# EAGLE design combined (EAGLE 6.6.0)
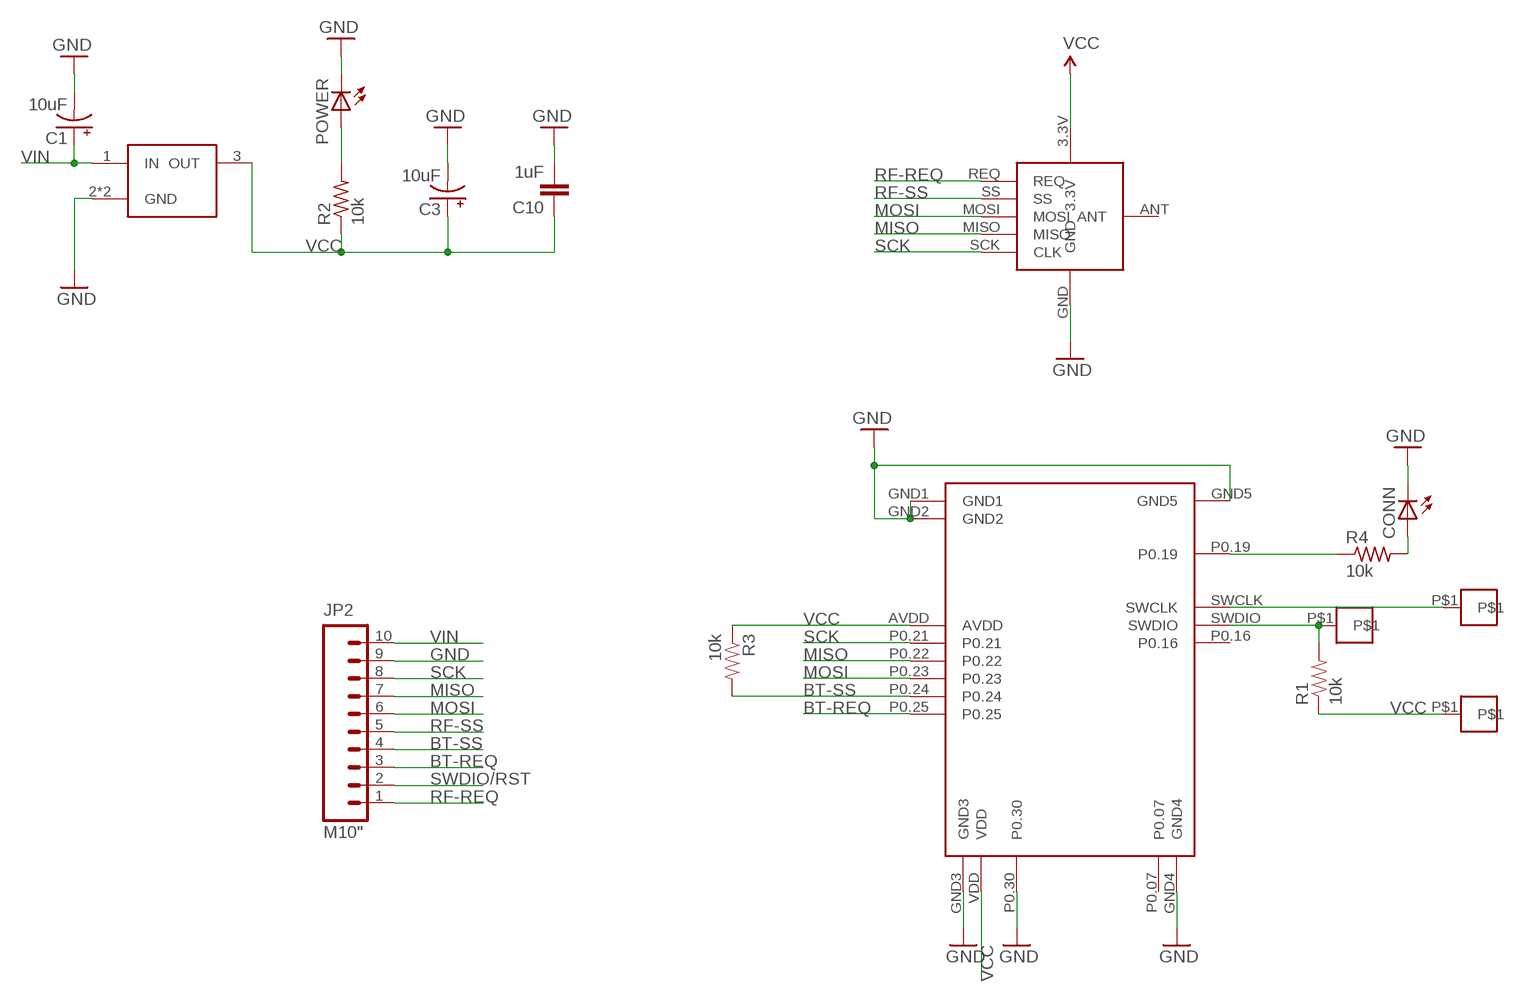
[diagram p0: schematic, sheet 1]

## Parts
C1  10uF  CAP_POL1206  [EIA3216]
C3  10uF  CAP_POL1206  [EIA3216]
C10  1uF  CAP0603-CAP  [0603-CAP]
CLOCK  PAD  [SMD-ROUND]
CLOCK1  PAD  [SMD-ROUND]
CONN  LEDCHIP-LED0603  [CHIP-LED0603]
JP2  M10"  [1X10]
POWER  LEDCHIP-LED0603  [CHIP-LED0603]
R1  10k  RESISTOR0603  [0603-RES]
R2  10k  R-US_R0603  [R0603]
R3  10k  RESISTOR0603  [0603-RES]
R4  10k  R-US_R0603  [R0603]
U$1  RFM69  [S0C-RFM69]
U$3  REGULATOR3.3V-UA78M33CDCYR  [SOT223]
U$5  NRF51-MDBT40-SPI  [SOC-NRF51-MDBT40-SPI]
VCC  PAD  [SMD-ROUND]

## Nets
BT-REQ: JP2.3 U$5.P0.25
BT-SS: JP2.4 R3.2 U$5.P0.24
GND [vcc]: C1.C(-) C3.C(-) C10.2 CONN.C JP2.9 POWER.C U$1.GND U$3.2(GND) U$3.4(GND) U$5.GND1 U$5.GND2 U$5.GND3 U$5.GND4 U$5.GND5 U$5.P0.30
MISO: JP2.7 U$1.MISO U$5.P0.22
MOSI: JP2.6 U$1.MOSI U$5.P0.23
N$1: POWER.A R2.2
N$2: R4.1 U$5.P0.19
N$4: CONN.A R4.2
N$11: CLOCK.P$1 U$5.SWCLK
RF-REQ: JP2.1 U$1.REQ
RF-SS: JP2.5 U$1.SS
SCK: JP2.8 U$1.SCK(CLK) U$5.P0.21
SWDIO/RST: CLOCK1.P$1 JP2.2 R1.2 U$5.SWDIO
VCC: C3.A(+) C10.1 R1.1 R2.1 R3.1 U$1.3.3V U$3.3(OUT) U$5.AVDD U$5.VDD VCC.P$1
VIN: C1.A(+) JP2.10 U$3.1(IN)
Unconnected: U$1.ANT U$5.P0.07 U$5.P0.16

## Library data of the parts
C1 C3 = SparkFun-Capacitors:CAP_POL: Capacitor Polarized These are standard SMD and PTH capacitors. Normally 10uF, 47uF, and 100uF in electrolytic and tantalum varieties. Always verify the external diameter of the through hole cap, it varies with capacity, voltage, and manufacturer. The EIA devices should be standard.
C10 = SparkFun:CAP: Capacitor Standard 0603 ceramic capacitor, and 0.1" leaded capacitor.
CLOCK CLOCK1 VCC = ITP_Lab:PAD
CONN POWER = adafruit:LED: LED OSRAM: - CHIPLED LG R971, LG N971, LY N971, LG Q971, LY Q971, LO R971, LY R971 LH N974, LH R974 LS Q976, LO Q976, LY Q976 LO Q996 - Hyper CHIPLED LW Q18S LB Q993, LB Q99A, LB R99A - SideLED LS A670, LO A670, LY A670, LG A670, LP A670 LB A673, LV A673, LT A673, LW A673 LH A674 LY A675 LS A676, LA A676, LO A676, LY A676, LW A676 LS A679, LY A679, LG A679 - Hyper Micro SIDELED® LS Y876, LA Y876, LO Y876, LY Y876 LT Y87S - SmartLED LW L88C, LW L88S LB L89C, LB L89S, LG L890 LS L89K, LO L89K, LY L89K LS L896, LA L896, LO L896, LY L896 - TOPLED LS T670, LO T670, LY T670, LG T670, LP T670 LSG T670, LSP T670, LSY T670, LOP T670, LYG T670 LG T671, LOG T671, LSG T671 LB T673, LV T673, LT T673, LW T673 LH T674 LS T676, LA T676, LO T676, LY T676, LB T676, LH T676, LSB T676, LW T676 LB T67C, LV T67C, LT T67C, LS T67K, LO T67K, LY T67K, LW E67C LS E67B, LA E67B, LO E67B, LY E67B, LB E67C, LV E67C, LT E67C LW T67C LS T679, LY T679, LG T679 LS T770, LO T770, LY T770, LG T770, LP T770 LB T773, LV T773, LT T773, LW T773 LH T774 LS E675, LA E675, LY E675, LS T675 LS T776, LA T776, LO T776, LY T776, LB T776 LHGB T686 LT T68C, LB T68C - Hyper Mini TOPLED® LB M676 - Mini TOPLED Santana® LG M470 LS M47K, LO M47K, LY M47K Source: http://www.osram.convergy.de/
JP2 = SparkFun-Connectors:M10: Header 10 Standard 10-pin 0.1" header. Use with straight break away headers (SKU : PRT-00116), right angle break away headers (PRT-00553), swiss pins (PRT-00743), machine pins (PRT-00117), and female headers (PRT-00115).
R1 R3 = SparkFun-Resistors:RESISTOR: Resistor Basic schematic elements and footprints for 0603, 1206, and PTH resistors.
R2 R4 = adafruit:R-US_: RESISTOR, American symbol
U$1 = ITP_Lab:RFM69
U$3 = ITP_Lab:REGULATOR
U$5 = ITP_Lab:NRF51-MDBT40-SPI

## Net classes
0 default: width 0.203 mm
1 vcc: width 0.254 mm

## Board
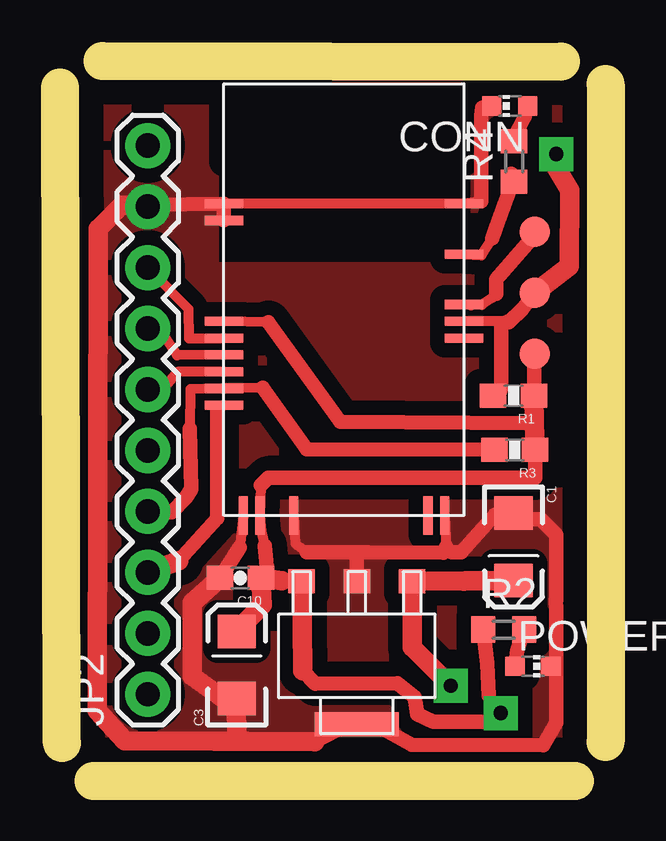
[diagram p1: board, top side]
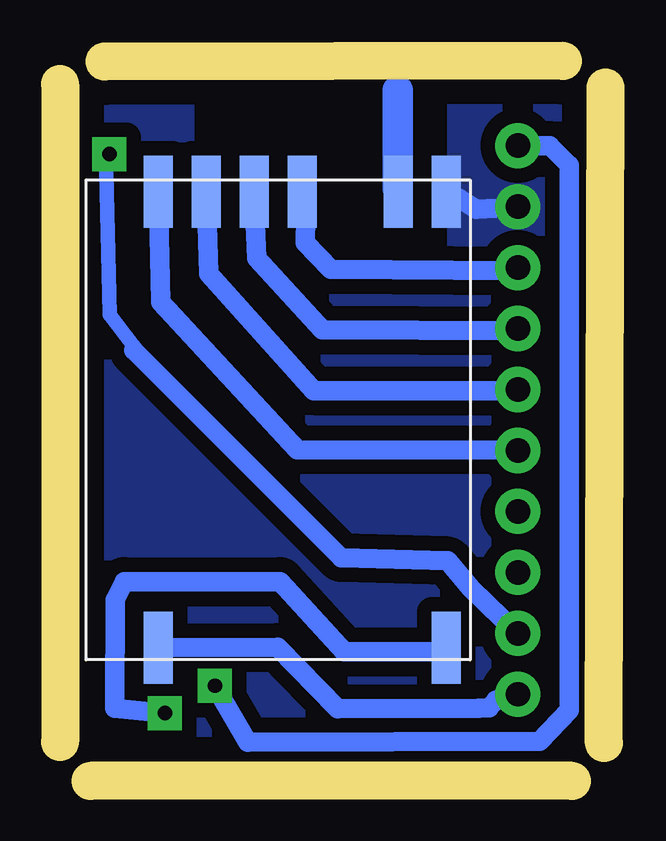
[diagram p2: board, bottom side, seen from below]

Size 22.73 x 30 mm. Coordinates in mm from the lower left corner, seen from the top.
Outline: 1.78,30 20.88,29.97
Outline: 22.73,29.03 22.73,1.63
Outline: 1.4,0 21.46,0
Outline: 0.08,1.58 0,28.88
Copper layers (1*16): Top 0.035mm / dielectric 1.5mm / Bottom 0.035mm
Design rules "default": minimum track width 10mil, minimum drill 24mil, track to track 8mil, track to pad 8mil, pad to pad 8mil, via to via 8mil, smd to smd 8mil, copper to edge 40mil, drill to drill 8mil, minimum pad ring 10mil, minimum via ring 8mil, stop-mask expansion 4mil, vias tented up to drill 0mil, thermal gap 10mil

### Footprints (pad centres in the part's own frame; a part is rotated, then mirrored left to right if it is on the bottom)
EIA3216 = smd 1.4 x 1.6: A 1.4,0; C -1.4,0
0603-CAP = smd 1.1 x 1: 1 -0.85,0; 2 0.85,0
SMD-ROUND = smd 1.27 x 1.27: P$1 0,0
CHIP-LED0603 = smd 0.8 x 0.8: A 0,-0.75; C 0,0.75
1X10 = drill 1.016 pad 1.88: 1 0,0; 2 2.54,0; 3 5.08,0; 4 7.62,0; 5 10.16,0; 6 12.7,0; 7 15.24,0; 8 17.78,0; 9 20.32,0; 10 22.86,0
0603-RES = smd 1.1 x 1: 1 -0.85,0; 2 0.85,0
R0603 = smd 1 x 1.1: 1 -0.85,0; 2 0.85,0
S0C-RFM69 = smd 3 x 1.2: 3.3V -9.5,-7; ANT 9.5,-5; GND 9.5,-7; MISO 9.5,1; MOSI 9.5,3; REQ -9.5,5; SCK 9.5,-1; SS 9.5,5
SOT223 = smd 1.1 x 1: 1 -2.3,-3.1; 2 0,-3.1; 3 2.3,-3.1 | smd 3.5 x 1: 4 0,2.85
SOC-NRF51-MDBT40-SPI = smd 1.6 x 0.381: AVDD -5.08,0.48; GND1 -5.08,5.38; GND2 -5.08,4.68; GND5 4.92,5.38; P0.16 4.92,-0.22; P0.19 4.92,3.28; P0.21 -5.08,-0.22; P0.22 -5.08,-0.92; P0.23 -5.08,-1.62; P0.24 -5.08,-2.32; P0.25 -5.08,-3.02; SWCLK 4.92,1.18; SWDIO 4.92,0.48 | smd 0.381 x 1.6: GND3 -4.28,-7.62; GND4 4.12,-7.62; P0.07 3.42,-7.62; P0.30 -2.18,-7.62; VDD -3.58,-7.62

### Placement (x,y rotation side)
C1  18.9,9.75 270 top
C3  7.37,4.83 90 top
C10  7.52,8.46 180 top
CLOCK  19.79,22.89 180 top
CLOCK1  19.79,20.35 0 top
CONN  18.75,28.12 90 top
JP2  3.66,3.61 90 top
POWER  19.71,4.78 270 top
R1  18.9,16.05 180 top
R2  18.49,6.3 0 top
R3  18.95,13.79 180 top
R4  18.92,25.81 90 top
U$1  13.64,15.04 90 bottom
U$3  12.37,5.21 180 top
U$5  11.91,18.67 0 top
VCC  19.79,17.81 180 top

### Tracks (layer width: path | path; a pad name or v marks a point on that pad's centre or on a via)
BT-REQ
  Top 0.406: 6.55,15.52 U$5.P0.25
  Top 0.61: 4.95,9.17 6.55,10.95 6.55,15.52 | JP2.3 3.5,8.69
  Top 0.813: 4.95,9.17 JP2.3
BT-SS
  Top 0.406: 5.41,14.68 5.44,16.33 U$5.P0.24 8.46,16.38 | 3.68,11.2 JP2.4
  Top 0.61: R3.2 10.29,13.82 8.46,16.38 | 5.41,14.68 5.46,12.14 5.23,11.79 4.65,11.2 3.68,11.2
GND
  Top 0.406: U$5.GND1 U$5.GND5 17.55,24.14 | U$5.GND4 16.08,9.74 16.33,9.53 | U$5.GND3 7.49,9.73 | U$5.P0.30 9.8,9.88 10.29,9.53 | POWER.C 20.68,4.95
  Top 0.61: U$5.GND2 U$5.GND1 3.73,24 | 7.49,9.73 C10.2 | 10.29,9.53 12.83,9.53 | 12.83,9.53 15.97,9.5 16.08,9.74 | U$3.2 12.37,9.5 12.83,9.53 | 16.33,9.53 16.71,9.53 18.11,11.08 C1.C 18.9,10.9 20.04,10.9 20.68,10.26 20.68,7.53 20.65,7.54 20.68,7.14 20.68,4.95 20.68,2.41 20.14,1.47 14.66,1.5 13.31,2.26 12.82,2.31 U$3.4 12.02,2.34 10.62,1.63 | CONN.C 17.6,28.04 17.55,27.71 17.55,24.14
  Top 0.813: 7.77,1.65 6.45,1.65 2.69,1.68 1.55,2.92 1.6,22.73 1.6,23.01 2.57,23.98 3.61,23.98 JP2.9 | 3.58,24 JP2.9 | 3.73,24 JP2.9 | C10.2 5.51,7.43 5.51,4.37 6.78,3.45 C3.C 7.34,3.38 7.36,1.65 7.77,1.65 | 7.77,1.65 10.62,1.63
  Bottom 0.813: U$1.GND 6.07,24.26 5.38,23.83 3.68,23.9 JP2.9
  pour Bottom (isolate 0.61, no thermals): 0.05,0.08 0.05,30.05 6.4,30.05 6.4,21.41 17.32,21.41 17.32,30.05 22.66,30.05 22.66,0.08
  pour Top (isolate 0.61, no thermals): 0.05,0.08 0.05,30.56 6.4,30.56 6.4,21.41 17.32,21.41 17.32,30.05 22.66,30.05 22.66,0.08
MISO
  Top 0.406: U$5.P0.22 4.88,17.73 4.14,18.85 JP2.7
  Bottom 0.813: U$1.MISO 14.6,23.19 14.53,21.77 11.81,18.8 3.76,18.75 JP2.7
MOSI
  Top 0.406: U$5.P0.23 4.9,17.04 4.29,16.31
  Top 0.61: JP2.6 4.29,16.31
  Bottom 0.813: U$1.MOSI 16.59,22.48 16.54,21.13 12.17,16.26 3.71,16.26 JP2.6
N$1
  Top 0.61: R2.2 19.05,5.44 POWER.A
N$2
  Top 0.406: U$5.P0.19 17.55,21.9 18.01,22.61 | 18.8,25.29 R4.1
  Top 0.61: 18.01,22.61 18.26,23.32 18.72,24.56 18.8,25.29
N$4
  Top 0.406: R4.2 18.78,26.5 | 19.35,27.67 CONN.A
  Top 0.61: 18.78,26.5 18.9,26.8 19.35,27.67
N$6
  Bottom 1.27: 8.66,24.7 8.66,28.77
N$11
  Top 0.406: U$5.SWCLK 17.12,19.81 17.58,19.84 18.03,20.14 18.19,20.29
  Top 0.61: CLOCK.P$1 19.58,22.53 18.19,20.9 18.19,20.29
RF-REQ
  Bottom 0.813: U$1.REQ 13.66,5.56 11.15,3 5.28,3.02 4.85,3.05 4.57,3.35 3.94,3.66 JP2.1
RF-SS
  Bottom 0.813: U$1.SS 18.54,19.94 12.85,13.79 JP2.5
SCK
  Top 0.406: U$5.P0.21 5.38,18.44 5.36,19.66 JP2.8
  Bottom 0.813: U$1.SCK 12.5,23.44 12.52,22.43 11.46,21.31 3.78,21.26 JP2.8
SWDIO/RST  (via drill 0.6 pad 1.42)
  Top 0.406: U$5.SWDIO 18.67,19.15 18.39,19.05
  Top 0.61: 18.67,19.15 18.41,19.08 18.69,19.1 19.25,19.66 CLOCK1.P$1 | R1.2 18.25,15.91 18.39,16.36 18.39,19.05 | v20.68,26.11 20.68,25.55
  Top 0.813: 20.68,25.55 21.23,24.61 21.21,21.44 CLOCK1.P$1
  Bottom 0.61: 19.66,17.93 19.66,18.11 20.65,19.43 20.83,26.24 v20.68,26.11
  Bottom 0.813: JP2.2 3.68,6.15 5.59,8 6.58,9.17 11.02,9.3 19.66,17.93
VCC  (via drill 0.6 pad 1.42)
  Top 0.406: 8.36,12.32 U$5.VDD 8.38,10.39 8.53,9.8 | 8.69,19.1 U$5.AVDD | v18.36,2.82 17.86,3.56
  Top 0.61: R1.1 VCC.P$1 | 8.36,12.32 8.69,12.62 19.81,12.62 R3.1 | 8.69,19.1 11.68,14.96 19.76,14.89 | v18.36,2.82 17.83,2.46 15.54,2.46 14.88,2.77 14.78,3.48 14.05,4.06 10.64,4.04 10.12,4.59 | U$3.3 9.23,8.33 | 8.53,9.8 8.66,8.5 C10.1 | R2.1 17.81,4.88 17.86,3.56
  Top 0.813: R3.1 19.76,14.89 R1.1 | C3.A 8.42,7.33 C10.1 9.23,8.33 | U$3.3 10.12,4.59
  Bottom 0.813: v18.36,2.82 20.45,3.02 20.42,7.54 20.07,8.31 13.56,8.31 10.9,5.39 6.79,5.39 U$1.3.3V
VIN  (via drill 0.6 pad 1.42)
  Top 0.61: 14.68,8.28 16.92,8.33
  Top 0.813: U$3.1 16.92,8.33 17.27,8.33 | 17.27,8.33 18.72,8.33 C1.A | 18.93,8.13 C1.A | 16.81,8.31 17.27,8.33 | 18.92,8.07 C1.A | 14.68,8.28 14.68,5.56 v16.28,3.96
  Bottom 0.813: JP2.10 2.34,26.47 1.52,25.65 1.52,2.95 2.74,1.65 14.91,1.6 v16.28,3.96